# EasyEDA schematic SCH_Hermes_For_Production_2023-01-27.json
TITLE: Hermes-1; REV: 1.0; Date: 2022-10-1; Sheet: 1/1; Drawn By: Osiris74; Company: ICAPPIC
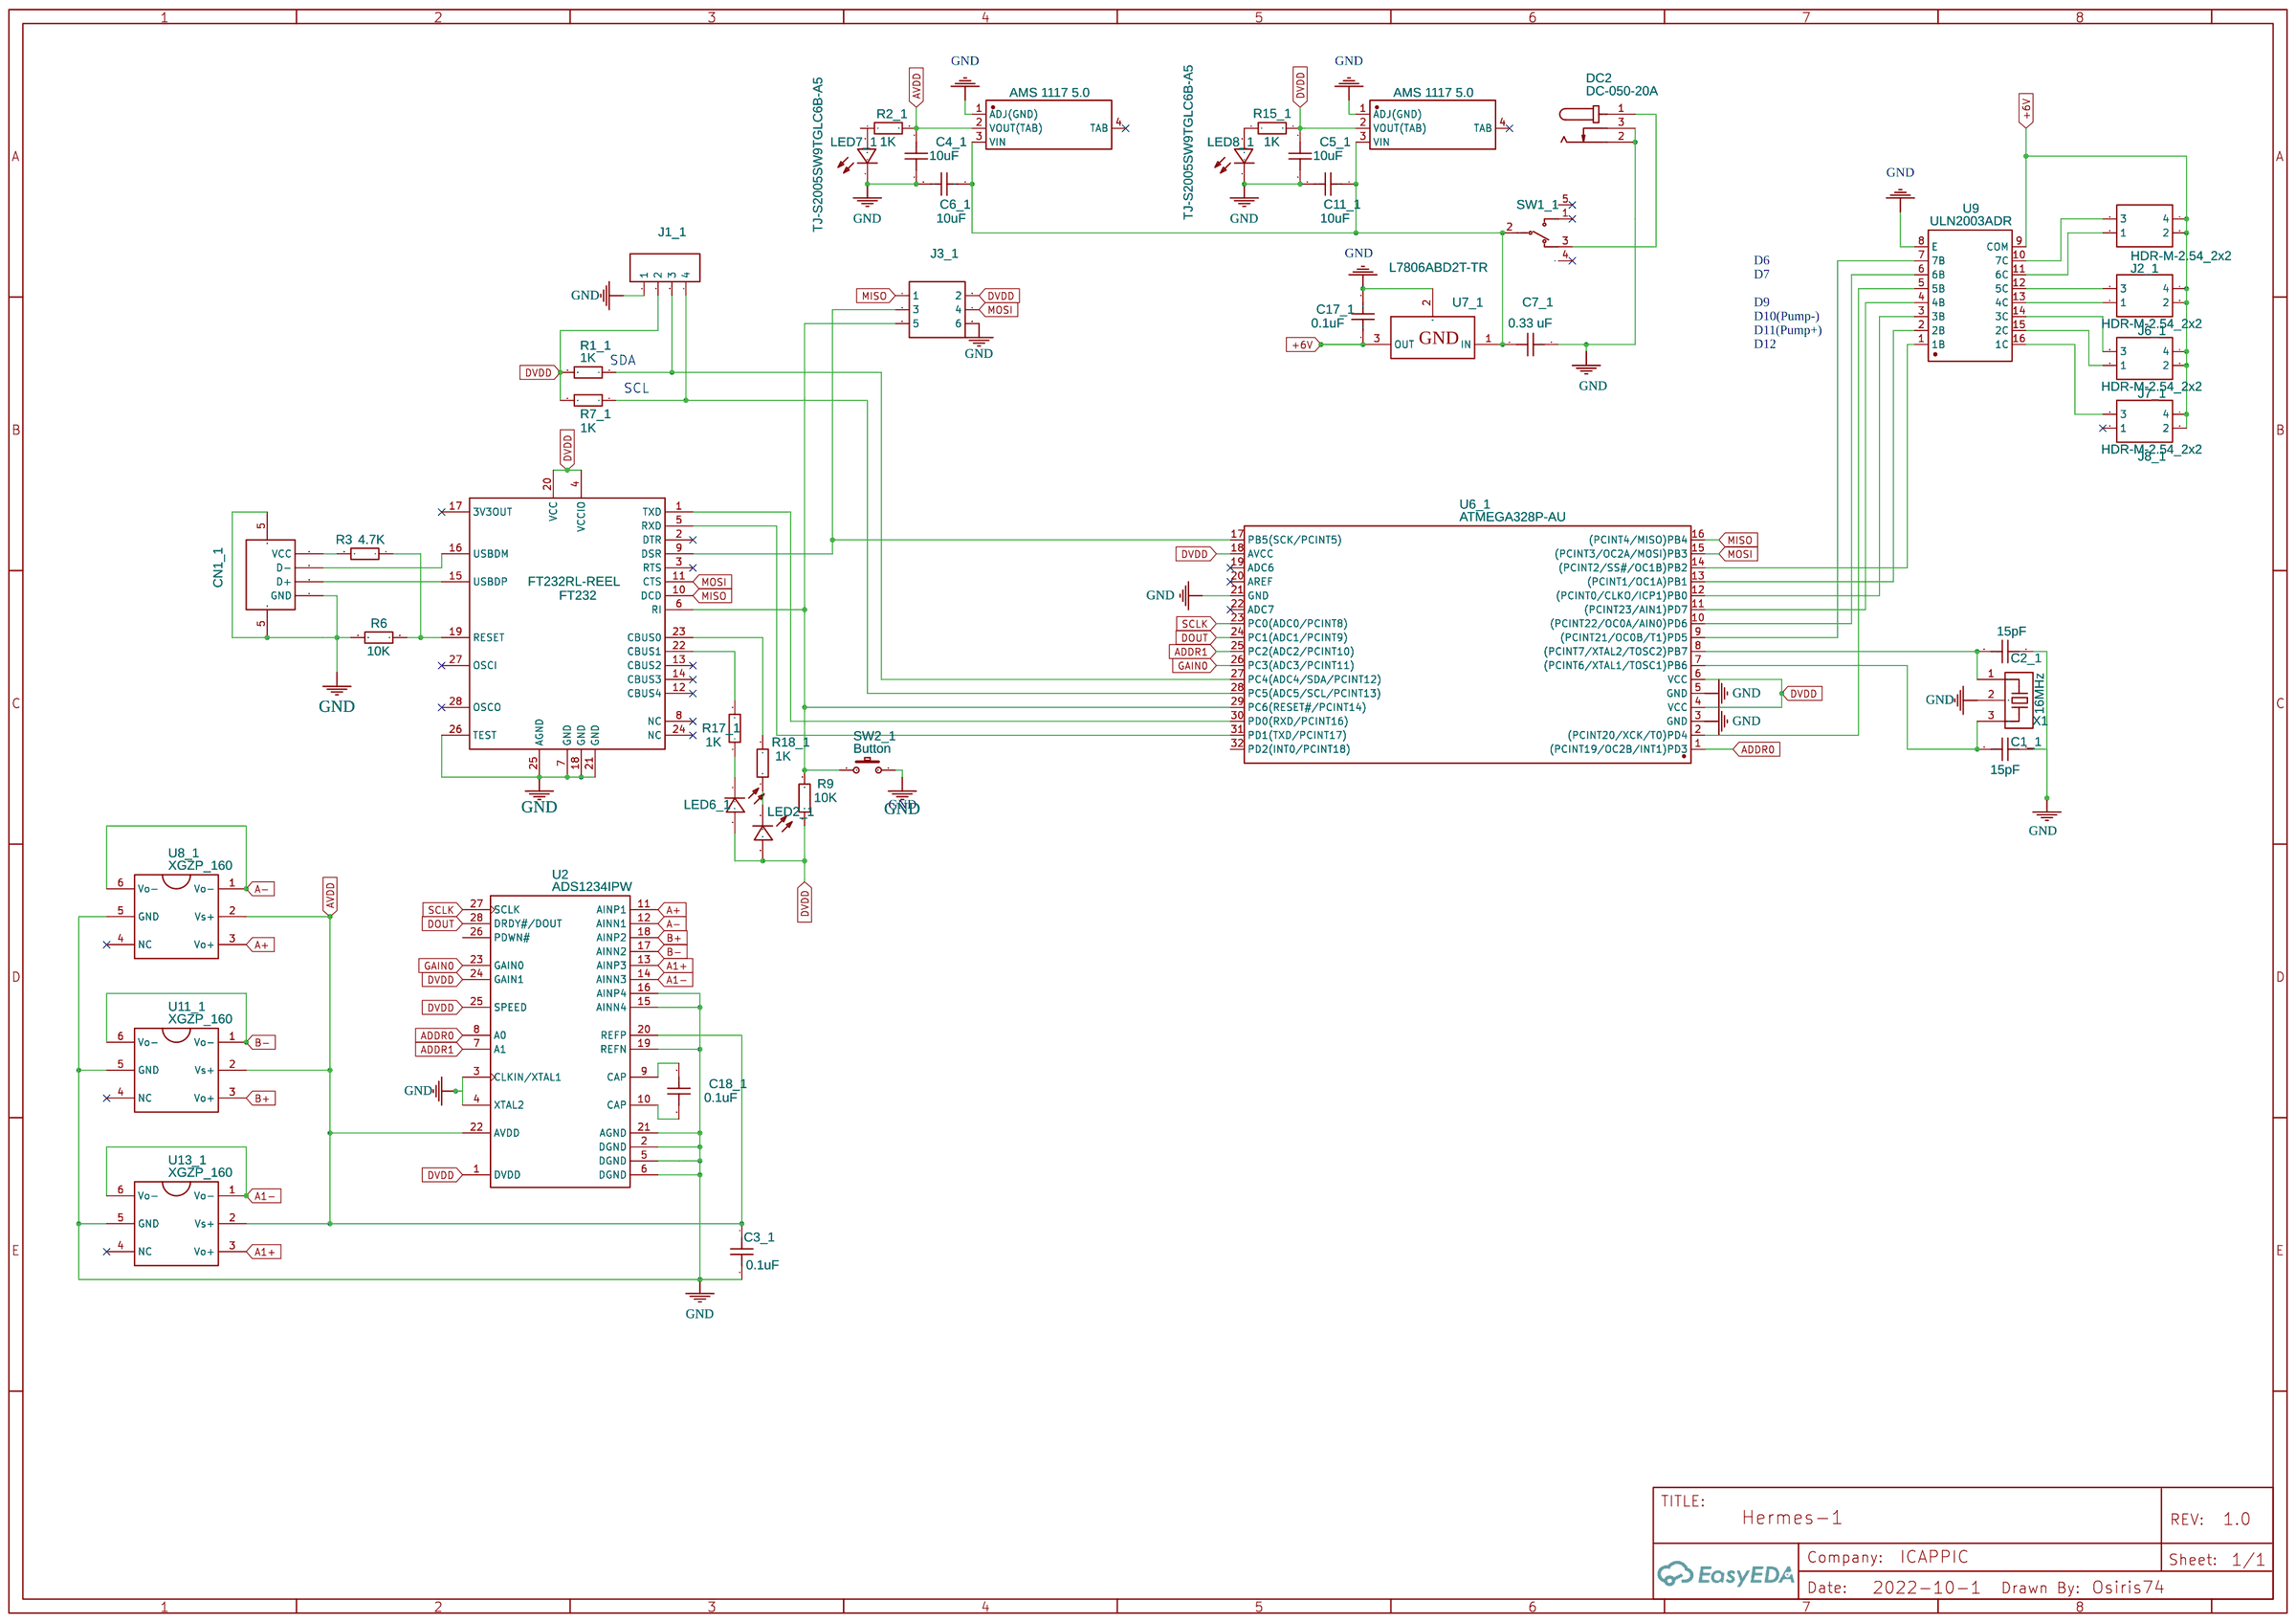
[diagram p0: schematic sheet]

## Parts
C1_1  15pF  [C0805]
C2_1  15pF  [C0805]
C3_1  0.1uF  [C0805]
C4_1  10uF  [C0805]
C5_1  10uF  [C0805]
C6_1  10uF  [C0805]
C7_1  0.33 uF  [C0805]
C11_1  10uF  [C0805]
C17_1  0.1uF  [C0805]
C18_1  0.1uF  [C0805]
CN1_1  USB-B-Female-90  [USB-B_TH_BF90]
DC2  DC-050-20A  [DC-IN-SMD_DC-050-20A]
FT232  FT232RL-REEL  [SSOP-28_L10.2-W5.3-P0.65-LS7.8-BL]
J1_1  HDR-M-2.54_1x4  [HDR-M-2.54_1X4]
J2_1  HDR-M-2.54_2x2  [HDR-M-2.54_2X2]
J3_1  HDR-M-2.54_2x3  [HDR-M-2.54_2X3]
J6_1  HDR-M-2.54_2x2  [HDR-M-2.54_2X2]
J7_1  HDR-M-2.54_2x2  [HDR-M-2.54_2X2]
J8_1  HDR-M-2.54_2x2  [HDR-M-2.54_2X2]
LED2_1  TJ-S2005SW9TGLC6B-A5  [LED-SMD_L2.0-W0.5_RD]
LED6_1  TJ-S2005SW9TGLC6B-A5  [LED-SMD_L2.0-W0.5_RD]
LED7_1  TJ-S2005SW9TGLC6B-A5  [LED-SMD_L2.0-W0.5_RD]
LED8_1  TJ-S2005SW9TGLC6B-A5  [LED-SMD_L2.0-W0.5_RD]
R1_1  1K  [R0805]
R2_1  1K  [R0805]
R3  4.7K  [R0805]
R6  10K  [R0805]
R7_1  1K  [R0805]
R9  10K  [R0805]
R15_1  1K  [R0805]
R17_1  1K  [R0805]
R18_1  1K  [R0805]
SW1_1  MR-0-102-A03-0003-RS  [SW-TH_MR-0-102-A03-0003-RS]
SW2_1  Button  [K2-1107ST-A4SW-06]
U1_1  AMS 1117 5.0  [SOT-223_L6.7-W3.5-P2.30-BR]
U2  ADS1234IPW  [TSSOP-28_L9.7-W4.4-P0.65-LS6.4-BL]
U3_1  AMS 1117 5.0  [SOT-223_L6.7-W3.5-P2.30-BR]
U6_1  ATMEGA328P-AU  [TQFP-32_L7.0-W7.0-P0.80-LS9.0-BL]
U7_1  L7806ABD2T-TR  [TO-263-2_L10.1-W9.1-P5.08-LS15.2-TL]
U8_1  XGZP_160  [XGZP6857D]
U9  ULN2003ADR  [SOIC-16_L9.9-W3.9-P1.27-LS6.0-BL]
U11_1  XGZP_160  [XGZP6857D]
U13_1  XGZP_160  [XGZP6857D]
X1  16MHz  [OSC-SMD_3P-L3.2-W1.3-P0.95-L]

## Library data of the parts
C1_1 C2_1 = 0402N150F500CT: Supplier: LCSC; Supplier Part: C396706; Manufacturer: Walsin Tech Corp; Contributor: LCSC
C3_1 C7_1 C17_1 C18_1 = C_0201_US: Contributor: LCEDA_Lib
C4_1 C5_1 C6_1 C11_1 = CL10A106KP8NNNC: Supplier: LCSC; Manufacturer: SAMSUNG; LCSC Assembly: Yes; Supplier Part: C19702; SMT Type: Basic
CN1_1 = USB-B-Female-90: Supplier: LCSC; Manufacturer: ValuePro; Manufacturer Part: USB-BF90; Supplier Part: C46392; JLCPCB Part Class: Extended Part
DC2 = DC-050-20A: Supplier: LCSC; Supplier Part: C707276; Manufacturer: 韩国韩荣; Contributor: LCSC; JLCPCB Part Class: Extended Part
FT232 = FT232RL-REEL: Supplier: LCSC; Manufacturer: FTDI; LCSC Assembly: Yes; image: //image.lceda.cn/szlcsc/C8690.jpg; Supplier Part: C8690; SMT Type: Basic
J1_1 = HDR-M-2.54_1x4: Supplier Part: C124378; Supplier: LCSC; Contributor: LCEDA_Lib
J2_1 J6_1 J7_1 J8_1 = HDR-M-2.54_2x2: Supplier Part: C66690; Supplier: LCSC; Contributor: LCEDA_Lib
J3_1 = HDR-M-2.54_2x3: Supplier Part: C65114; Supplier: LCSC; Contributor: LCEDA_Lib
LED2_1 LED6_1 LED7_1 LED8_1 = TJ-S2005SW9TGLC6B-A5: Supplier: LCSC; Supplier Part: C273624; Manufacturer: TOGIALED; Contributor: LCSC
R1_1 R2_1 R7_1 R15_1 R17_1 R18_1 = 0805W8F1001T5E: Supplier: LCSC; Manufacturer: UniOhm; LCSC Assembly: Yes; Supplier Part: C17513; SMT Type: Basic
R3 = 0805W8F4701T5E: Supplier: LCSC; Manufacturer: UniOhm; Supplier Part: C17673; SMT Type: Basic; JLCPCB SMD: Yes
R6 R9 = 0805W8F1002T5E: Supplier: LCSC; Manufacturer: UniOhm; Supplier Part: C17414; SMT Type: Basic; JLCPCB SMD: Yes
SW1_1 = MR-0-102-A03-0003-RS: Supplier: LCSC; Supplier Part: C1788503; Manufacturer: YUEN FUNG(源丰); Contributor: LCSC; JLCPCB Part Class: Extended Part
SW2_1 = Button: Supplier: LCSC; Supplier Part: C118141; Manufacturer: Rectangular Connectors - Contacts; Contributor: jousterde1
U1_1 U3_1 = AMS1117-5.0_C347223: Supplier: LCSC; Supplier Part: C347223; Manufacturer: Youtai Semiconductor Co., Ltd.; Manufacturer Part: AMS1117-5.0; Contributor: LCSC; LCSC Assembly: Yes; SMT Type: Extend
U2 = ADS1234IPW: Supplier: LCSC; Supplier Part: C67224; Manufacturer: Texas Instruments; Contributor: LCSC; LCSC Assembly: Yes; SMT Type: Extend
U6_1 = ATMEGA328P-AU: Supplier: LCSC; Manufacturer: MICROCHIP; image: //image.lceda.cn/szlcsc/C14877.jpg; Supplier Part: C14877; LCSC Assembly: Yes; SMT Type: Extend
U7_1 = L7806ABD2T-TR: Supplier: LCSC; Manufacturer: STMicroelectronics; Supplier Part: C26467; LCSC Assembly: Yes; SMT Type: Extend
U8_1 U11_1 U13_1 = XGZP6857D: Contributor: LiveSparks
U9 = ULN2003ADR: Supplier: LCSC; Manufacturer: TI; image: //image.lceda.cn/szlcsc/C7512.jpg; Supplier Part: C7512; SMT Type: Basic; JLCPCB SMD: Yes
X1 = CSTCE16M0V53-R0: Supplier: LCSC; Manufacturer: MuRata; Supplier Part: C32180

## Nets
+6V: C17_1.1 J2_1.2 J2_1.4 J6_1.2 J6_1.4 J7_1.2 J7_1.4 J8_1.2 J8_1.4 U7_1.3(OUT) U9.9(COM)
AVDD: C3_1.1 C4_1.1 R2_1.2 U2.20(REFP) U2.22(AVDD) U3_1.2(VOUT(TAB)) U8_1.2(Vs+) U11_1.2(Vs+) U13_1.2(Vs+)
DVDD: C5_1.1 FT232.4(VCCIO) FT232.20(VCC) J1_1.2 J3_1.2 LED2_1.2 LED6_1.2 R1_1.2 R7_1.2 R9.1 R15_1.2 U1_1.2(VOUT(TAB)) U2.1(DVDD) U2.24(GAIN1) U2.25(SPEED) U6_1.4(VCC) U6_1.6(VCC) U6_1.18(AVCC)
GND: C1_1.1 C2_1.1 C3_1.2 C4_1.2 C5_1.2 C6_1.2 C7_1.2 C11_1.2 C17_1.2 CN1_1.4(GND) CN1_1.5(SH2) DC2.2 DC2.3 FT232.7(GND) FT232.18(GND) FT232.21(GND) FT232.25(AGND) FT232.26(TEST) J1_1.1 J3_1.6 LED7_1.1 LED8_1.1 R6.2 SW2_1.2 U1_1.1(ADJ(GND)) U2.2(DGND) U2.3(CLKIN/XTAL1) U2.4(XTAL2) U2.5(DGND) U2.6(DGND) U2.15(AINN4) U2.16(AINP4) U2.19(REFN) U2.21(AGND) U3_1.1(ADJ(GND)) U6_1.3(GND) U6_1.5(GND) U6_1.21(GND) U7_1.2(GND) U8_1.5(GND) U9.8(E) U11_1.5(GND) U13_1.5(GND) X1.2
A1+: U2.13(AINP3) U13_1.3(Vo+)
A1-: U2.14(AINN3) U13_1.1(Vo-) U13_1.6(Vo-)
A+: U2.11(AINP1) U8_1.3(Vo+)
A-: U2.12(AINN1) U8_1.1(Vo-) U8_1.6(Vo-)
ADDR0: U2.8(A0) U6_1.1((PCINT19/OC2B/INT1)PD3)
ADDR1: U2.7(A1) U6_1.25(PC2(ADC2/PCINT10))
B+: U2.18(AINP2) U11_1.3(Vo+)
B-: U2.17(AINN2) U11_1.1(Vo-) U11_1.6(Vo-)
DOUT: U2.28(DRDY#/DOUT) U6_1.24(PC1(ADC1/PCINT9))
GAIN0: U2.23(GAIN0) U6_1.26(PC3(ADC3/PCINT11))
MISO: FT232.10(DCD) J3_1.1 U6_1.16((PCINT4/MISO)PB4)
MOSI: FT232.11(CTS) J3_1.4 U6_1.15((PCINT3/OC2A/MOSI)PB3)
SCLK: U2.27(SCLK) U6_1.23(PC0(ADC0/PCINT8))
Net-(C1_1-2): C1_1.2 U6_1.7((PCINT6/XTAL1/TOSC1)PB6) X1.3
Net-(C2_1-2): C2_1.2 U6_1.8((PCINT7/XTAL2/TOSC2)PB7) X1.1
Net-(C6_1-1): C6_1.1 C7_1.1 C11_1.1 SW1_1.2 U1_1.3(VIN) U3_1.3(VIN) U7_1.1(IN)
Net-(C18_1-1): C18_1.1 U2.9(CAP)
Net-(C18_1-2): C18_1.2 U2.10(CAP)
Net-(CN1_1-1): CN1_1.1(VCC) R3.2
Net-(CN1_1-2): CN1_1.2(D-) FT232.16(USBDM)
Net-(CN1_1-3): CN1_1.3(D+) FT232.15(USBDP)
Net-(DC2-1): DC2.1 SW1_1.3
Net-(FT232-1): FT232.1(TXD) U6_1.30(PD0(RXD/PCINT16))
Net-(FT232-5): FT232.5(RXD) U6_1.31(PD1(TXD/PCINT17))
Net-(FT232-6): FT232.6(RI) J3_1.5 R9.2 SW2_1.1 U6_1.29(PC6(RESET#/PCINT14))
Net-(FT232-9): FT232.9(DSR) J3_1.3 U6_1.17(PB5(SCK/PCINT5))
Net-(FT232-19): FT232.19(RESET) R3.1 R6.1
Net-(FT232-22): FT232.22(CBUS1) R17_1.2
Net-(FT232-23): FT232.23(CBUS0) R18_1.2
Net-(J1_1-3): J1_1.3 R1_1.1 U6_1.27(PC4(ADC4/SDA/PCINT12))
Net-(J1_1-4): J1_1.4 R7_1.1 U6_1.28(PC5(ADC5/SCL/PCINT13))
Net-(J2_1-1): J2_1.1 U9.11(6C)
Net-(J2_1-3): J2_1.3 U9.10(7C)
Net-(J6_1-1): J6_1.1 U9.13(4C)
Net-(J6_1-3): J6_1.3 U9.12(5C)
Net-(J7_1-1): J7_1.1 U9.15(2C)
Net-(J7_1-3): J7_1.3 U9.14(3C)
Net-(J8_1-3): J8_1.3 U9.16(1C)
Net-(LED2_1-1): LED2_1.1 R18_1.1
Net-(LED6_1-1): LED6_1.1 R17_1.1
Net-(LED7_1-2): LED7_1.2 R2_1.1
Net-(LED8_1-2): LED8_1.2 R15_1.1
Net-(U6_1-2): U6_1.2((PCINT20/XCK/T0)PD4) U9.5(5B)
Net-(U6_1-9): U6_1.9((PCINT21/OC0B/T1)PD5) U9.7(7B)
Net-(U6_1-10): U6_1.10((PCINT22/OC0A/AIN0)PD6) U9.6(6B)
Net-(U6_1-11): U6_1.11((PCINT23/AIN1)PD7) U9.4(4B)
Net-(U6_1-12): U6_1.12((PCINT0/CLKO/ICP1)PB0) U9.3(3B)
Net-(U6_1-13): U6_1.13((PCINT1/OC1A)PB1) U9.2(2B)
Net-(U6_1-14): U6_1.14((PCINT2/SS#/OC1B)PB2) U9.1(1B)

Not connected (* = marked no-connect by the designer): FT232 2(DTR)* 3(RTS)* 8(NC)* 12(CBUS4)* 13(CBUS2)* 14(CBUS3)* 17(3V3OUT)* 24(NC)* 27(OSCI)* 28(OSCO)*; J8_1 1*; SW1_1 1* 4* 5*; U1_1 4(TAB)*; U2 26(PDWN#); U3_1 4(TAB)*; U6_1 19(ADC6)* 20(AREF)* 22(ADC7)* 32(PD2(INT0/PCINT18)); U8_1 4(NC)*; U11_1 4(NC)*; U13_1 4(NC)*

## Notes on the sheet
- D6
- D7
- D10(Pump-)
- D9
- D11(Pump+)
- D12
- SDA
- SCL
- GND
